# EasyEDA schematic SCH_E-ink-smart-alarm-clock_2025-11-20.json
TITLE: Sheet_1; REV: 1.0; Date: 2025-09-23; Sheet: 1/1; Drawn By: Inżynier Domu; Company: Your Company
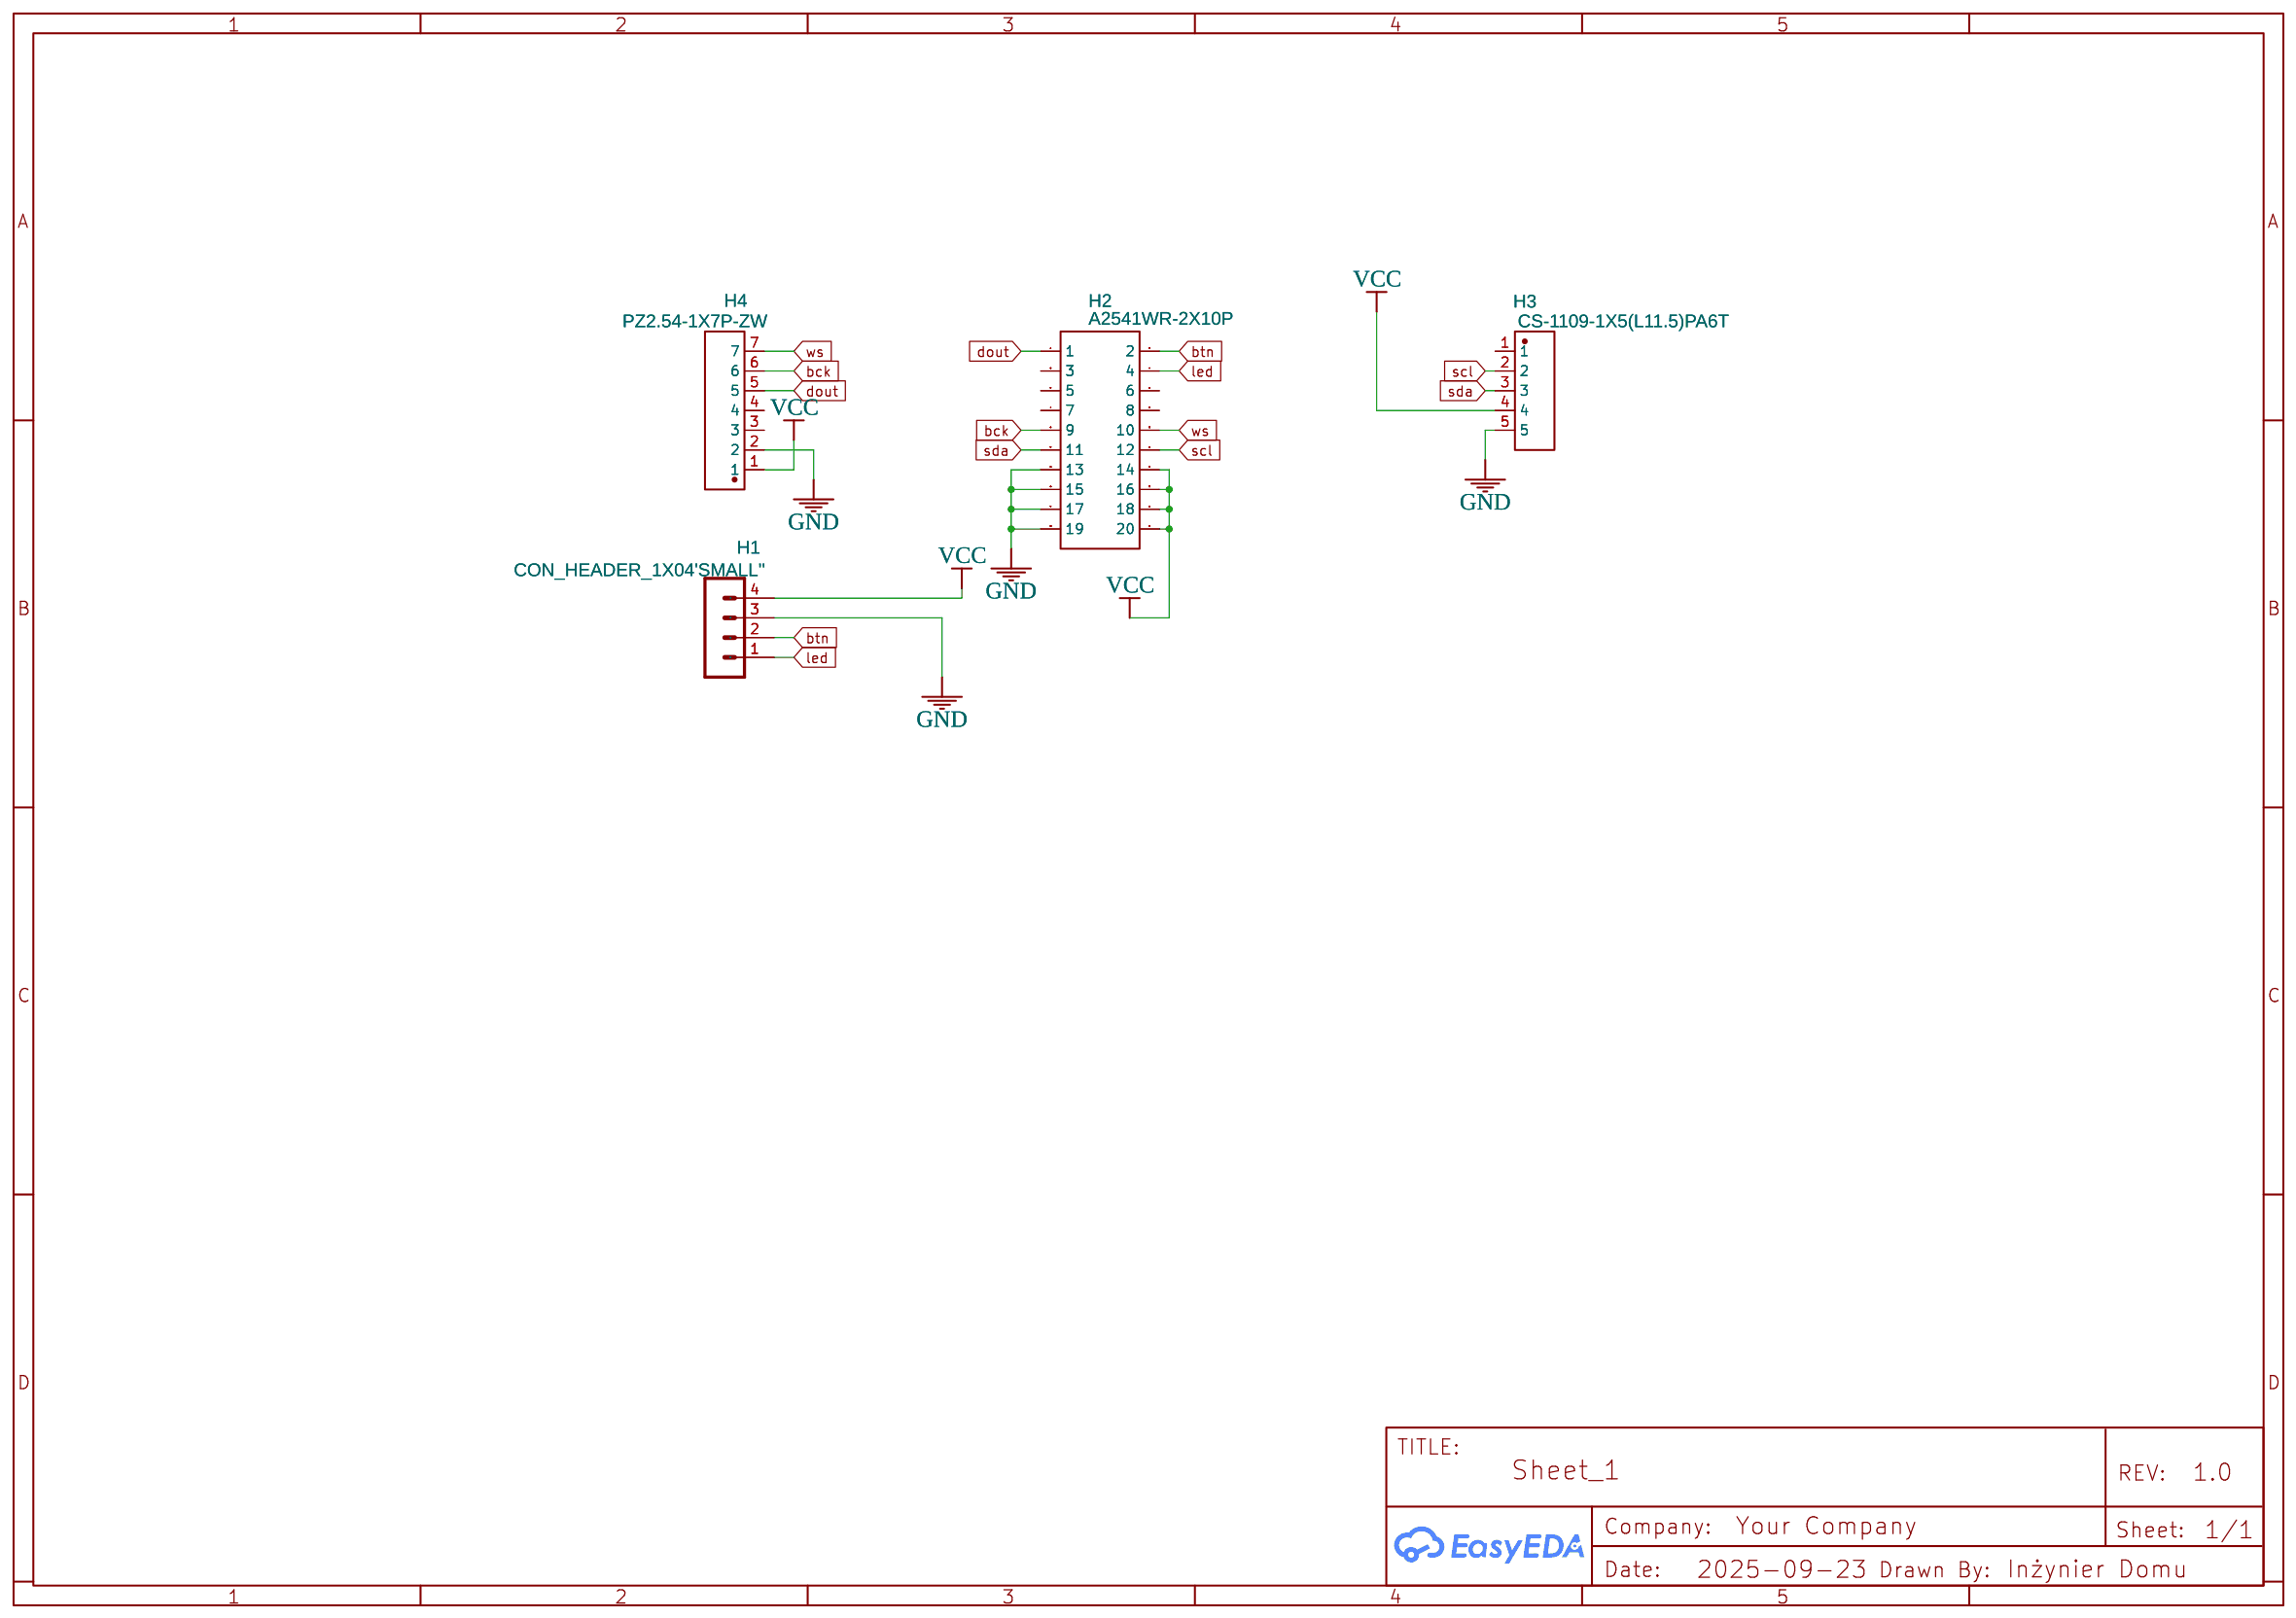
[diagram p0: schematic sheet]

## Parts
H1  CON_HEADER_1X04'SMALL''  [M1X4]
H2  A2541WR-2X10P  [CONN-TH_A2541WR-2X10P]
H3  CS-1109-1X5(L11.5)PA6T  [CONN-TH_CS-1109-1X5-L11.5-PA6T]
H4  PZ2.54-1X7P-ZW  [CONN-TH_PZ2.54-1X7P-ZW]

## Library data of the parts
H1 = CON_HEADER_1X04'SMALL'': Contributor: Idanronen
H2 = A2541WR-2X10P: Contributor: LCSC; Supplier: LCSC; Supplier Part: C239341; Manufacturer: CJT(长江连接器); Manufacturer Part: A2541WR-2x10P; JLCPCB Part Class: Extended Part
H3 = CS-1109-1X5(L11.5)PA6T: Supplier: LCSC; Supplier Part: C18213720; Manufacturer: CST(永丰盈); JLCPCB Part Class: Extended Part; Contributor: lcsc
H4 = PZ2.54-1X7P-ZW: JLCPCB Part Class: Extended Part; Contributor: LCSC; Supplier: LCSC; Supplier Part: C2838018; Manufacturer: null

## Nets
GND: H1.3 H2.13 H2.15 H2.17 H2.19 H3.5 H4.2
VCC: H1.4 H2.14 H2.16 H2.18 H2.20 H3.4 H4.1
bck: H2.9 H4.6
btn: H1.2 H2.2
dout: H2.1 H4.5
led: H1.1 H2.4
scl: H2.12 H3.2
sda: H2.11 H3.3
ws: H2.10 H4.7

Not connected (* = marked no-connect by the designer): H2 3 5 6 7 8; H3 1; H4 3 4
